# Altium project Shield_arduino_Due.PrjPCB
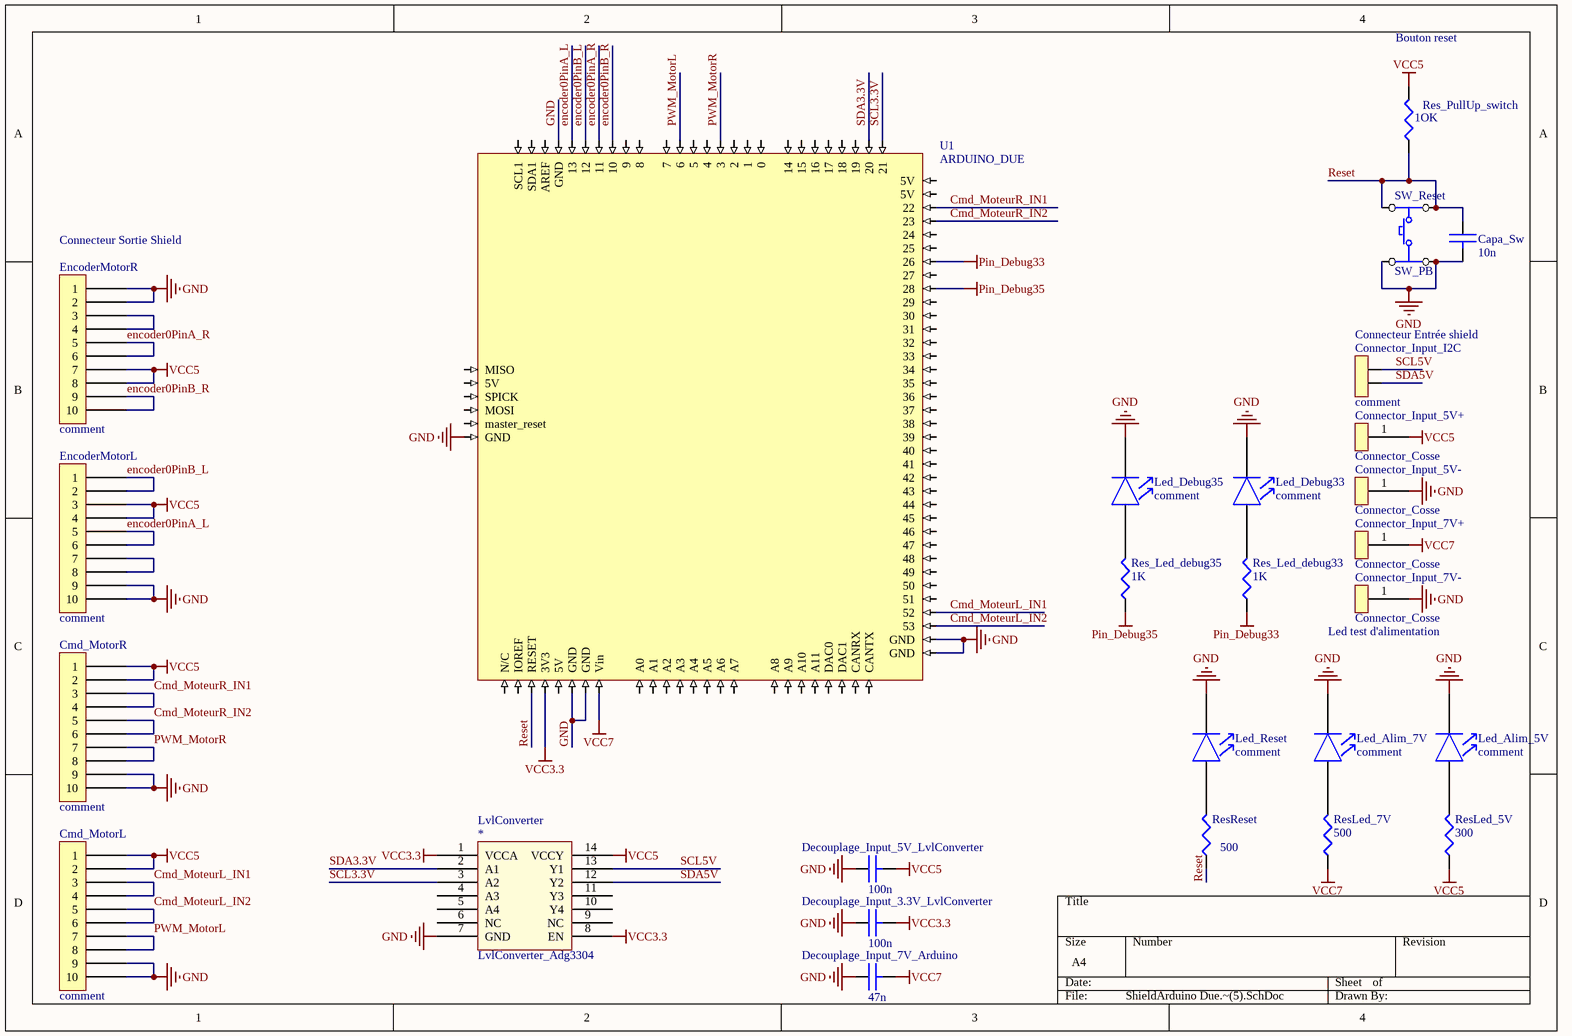
[diagram p0: ShieldArduino Due.~(5).SchDoc]
1 sheet, 27 parts. Net scope: global (net labels, ports and power ports of the same name join across sheets).
Board file: Shield_Arduino_Due.PCBDOC

## Sheet ShieldArduino Due.~(5).SchDoc
size A4

### Parts
*  LvlConverter_Adg3304  [LvlConverter_Adg3304]
Capa_Sw  value 10n  [0805]  (hidden comment: CAP)
Cmd_MotorL  comment  [HE10-10V]
Cmd_MotorR  comment  [HE10-10V]
Connector_Input_5V+  Connector_Cosse  [Connector_Cosse]
Connector_Input_5V-  Connector_Cosse  [Connector_Cosse]
Connector_Input_7V+  Connector_Cosse  [Connector_Cosse]
Connector_Input_7V-  Connector_Cosse  [Connector_Cosse]
Connector_Input_I2C  comment  [AMP_2]
Decouplage_Input_3.3V_LvlConverter  value 100n  [0805]  (hidden comment: CAP)
Decouplage_Input_5V_LvlConverter  value 100n  [0805]  (hidden comment: CAP)
Decouplage_Input_7V_Arduino  value 47n  [0805]  (hidden comment: CAP)
EncoderMotorL  comment  [HE10-10V]
EncoderMotorR  comment  [HE10-10V]
Led_Alim_5V  comment  [LED0805]
Led_Alim_7V  comment  [LED0805]
Led_Debug33  comment  [LED0805]
Led_Debug35  comment  [LED0805]
Led_Reset  comment  [LED0805]
Res_Led_debug33  value 1K  [0805]  (hidden comment: RES)
Res_Led_debug35  value 1K  [0805]  (hidden comment: RES)
Res_PullUp_switch  value 1OK  [0805]  (hidden comment: RES)
ResLed_5V  value 300  [0805]  (hidden comment: RES)
ResLed_7V  value 500  [0805]  (hidden comment: RES)
ResReset  value 500  [0805]  (hidden comment: RES)
SW_Reset  SW_PB  [KSA]
U1  ARDUINO_DUE  [ARDUINO_DUE]

### Nets
GND: *.7(GND) Capa_Sw.2 Cmd_MotorL.9 Cmd_MotorL.10 Cmd_MotorR.9 Cmd_MotorR.10 Connector_Input_5V-.1 Connector_Input_7V-.1 Decouplage_Input_3.3V_LvlConverter.1 Decouplage_Input_5V_LvlConverter.1 Decouplage_Input_7V_Arduino.1 EncoderMotorL.9 EncoderMotorL.10 EncoderMotorR.1 EncoderMotorR.2 Led_Alim_5V.K Led_Alim_7V.K Led_Debug33.K Led_Debug35.K Led_Reset.K SW_Reset.1 SW_Reset.2 U1.4(GND) U1.61(GND) U1.62(GND) U1.80(GND) U1.81(GND) U1.92(GND)
Pin_Debug33: Res_Led_debug33.1 U1.33(26)
Pin_Debug35: Res_Led_debug35.1 U1.35(28)
VCC3.3: *.1(VCCA) *.8(EN) Decouplage_Input_3.3V_LvlConverter.2 U1.83(3V3)
VCC5: *.14(VCCY) Cmd_MotorL.1 Cmd_MotorL.2 Cmd_MotorR.1 Cmd_MotorR.2 Connector_Input_5V+.1 Decouplage_Input_5V_LvlConverter.2 EncoderMotorL.3 EncoderMotorL.4 EncoderMotorR.7 EncoderMotorR.8 Res_PullUp_switch.2 ResLed_5V.1
VCC7: Connector_Input_7V+.1 Decouplage_Input_7V_Arduino.2 ResLed_7V.1 U1.79(Vin)
Cmd_MoteurL_IN1: Cmd_MotorL.3 Cmd_MotorL.4 U1.59(52)
Cmd_MoteurL_IN2: Cmd_MotorL.5 Cmd_MotorL.6 U1.60(53)
Cmd_MoteurR_IN1: Cmd_MotorR.3 Cmd_MotorR.4 U1.29(22)
Cmd_MoteurR_IN2: Cmd_MotorR.5 Cmd_MotorR.6 U1.30(23)
encoder0PinA_L: EncoderMotorL.5 EncoderMotorL.6 U1.5(13)
encoder0PinA_R: EncoderMotorR.5 EncoderMotorR.6 U1.7(11)
encoder0PinB_L: EncoderMotorL.1 EncoderMotorL.2 U1.6(12)
encoder0PinB_R: EncoderMotorR.9 EncoderMotorR.10 U1.8(10)
PWM_MotorL: Cmd_MotorL.7 Cmd_MotorL.8 U1.12(6)
PWM_MotorR: Cmd_MotorR.7 Cmd_MotorR.8 U1.15(3)
Reset: Capa_Sw.1 Res_PullUp_switch.1 ResReset.1 SW_Reset.3 SW_Reset.4 U1.84(RESET)
SCL3.3V: *.3(A2) U1.26(21)
SCL5V: *.13(Y1) Connector_Input_I2C.1
SDA3.3V: *.2(A1) U1.25(20)
SDA5V: *.12(Y2) Connector_Input_I2C.2
NetEncoderMotorL_7: EncoderMotorL.7 EncoderMotorL.8
NetEncoderMotorR_3: EncoderMotorR.3 EncoderMotorR.4
NetLed_Alim_5V_A: Led_Alim_5V.A ResLed_5V.2
NetLed_Alim_7V_A: Led_Alim_7V.A ResLed_7V.2
NetLed_Debug33_A: Led_Debug33.A Res_Led_debug33.2
NetLed_Debug35_A: Led_Debug35.A Res_Led_debug35.2
NetLed_Reset_A: Led_Reset.A ResReset.2

Not connected (* = marked no-connect by the designer): * 4(A3) 5(A4) 6(NC) 9(NC) 10(Y4) 11(Y3); U1 1(SCL1) 2(SDA1) 3(AREF) 9 10(8) 11(7) 13(5) 14(4) 16(2) 17(1) 18(0) 19(14) 20(15) 21(16) 22(17) 23(18) 24(19) 27(5V) 28(5V) 31(24) 32(25) 34(27) 36(29) 37(30) 38(31) 39(32) 40(33) 41(34) 42(35) 43(36) 44(37) 45(38) 46(39) 47(40) 48(41) 49(42) 50(43) 51(44) 52(45) 53(46) 54(47) 55(48) 56(49) 57(50) 58(51) 63(CANTX) 64(CANRX) 65(DAC1) 66(DAC0) 67(A11) 68(A10) 69(A9) 70(A8) 71(A7) 72(A6) 73(A5) 74(A4) 75(A3) 76(A2) 77(A1) 78(A0) 82(5V) 85(IOREF) 86(N/C) 87(MISO) 88(5V) 89(SPICK) 90(MOSI) 91(master_reset)

### Notes on the sheet
- Bouton reset
- (near EncoderMotorR) Connecteur Sortie Shield
- (near Connector_Input_I2C) Connecteur Entrée shield
- (near Connector_Input_7V-) Led test d'alimentation
- (near *) LvlConverter

### Library data of the parts
Capa_Sw Decouplage_Input_3.3V_LvlConverter Decouplage_Input_5V_LvlConverter Decouplage_Input_7V_Arduino = CAP: capacité non polarisée
Cmd_MotorL Cmd_MotorR EncoderMotorL EncoderMotorR = HE10-10: 10-pin connector
Connector_Input_I2C = POWER2: connecteur alim 2 pôles
Led_Alim_5V Led_Alim_7V Led_Debug33 Led_Debug35 Led_Reset = LED: LED 5mm/3mm/CMS
Res_Led_debug33 Res_Led_debug35 Res_PullUp_switch ResLed_5V ResLed_7V ResReset = RES: resistance